# Altium schematic sheet Bipolar_HCP.SchDoc
size A
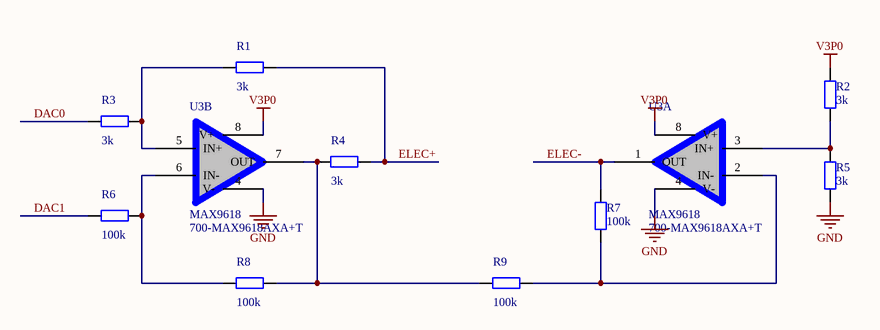
[diagram p0: Bipolar_HCP.SchDoc]

## Parts
R1  value 3k  [0402]  (hidden comment: Res2)
R2  value 3k  [0201]  (hidden comment: Res2)
R3  value 3k  [0402]  (hidden comment: Res2)
R4  value 3k  [0201]  (hidden comment: Res2)
R5  value 3k  [0201]  (hidden comment: Res2)
R6  value 100k  [0201]  (hidden comment: Res2)
R7  value 100k  [0201]  (hidden comment: Res2)
R8  value 100k  [0201]  (hidden comment: Res2)
R9  value 100k  [0201]  (hidden comment: Res2)
U3  MAX9618  Supplier Part Number 1: 700-MAX9618AXA+T  [MAX_X8CN_SC70_8]  (parts A,B of 2)

## Nets
GND: R5.2 U3.4(V-)
V3P0: R2.1 U3.8(V+)
DAC0: R3.2
DAC1: R6.2
ELEC+: R1.1 R4.1
ELEC-: R7.1 U3.1(OUT)
NetR1_2: R1.2 R3.1 U3.5(IN+)
NetR2_2: R2.2 R5.1 U3.3(IN+)
NetR4_2: R4.2 R8.1 R9.2 U3.7(OUT)
NetR6_1: R6.1 R8.2 U3.6(IN-)
NetR7_2: R7.2 R9.1 U3.2(IN-)

## Library data of the parts
R1-R9 = Res2: Resistor; Category: Resistors
U3 = MAX9618: Manufacturer: Maxim Integrated Products; Manufacturer Part Number: MAX9618AXA+T; Description: Op Amps Dual Auto-Zero Op Amp; Input Bias Current (Max): 3.5 nA; Supply Current: 59 uA; Common Mode Rejection Ratio (Min): 116 dB; Slew Rate: 0.7 V/us; Input Offset Voltage: 0.8 uV; Product Status: New at Mouser; Supplier 1: Mouser; RoHS: RoHS Compliant; Category: Op Amps; Stock 1: 1997; Pricing 1: 1=3.95, 25=2.92, 100=2.12, 500=1.84 (USD); Package / Case: SC70-8; Packaging: Reel; Mounting Style: SMD/SMT; Maximum Operating Temperature: + 125 C; Minimum Operating Temperature: - 40 C; Standard Pack Qty: 2500; RoHS - Mouser: Y; Minimum Order Quantity: 1; Reeling: True; ComponentLink1URL: http://datasheets.maxim-ic.com/en/ds/MAX9617-MAX9620.pdf; ComponentLink1Description: http://datasheets.maxim-ic.com/en/ds/MAX9617-MAX9620.pdf